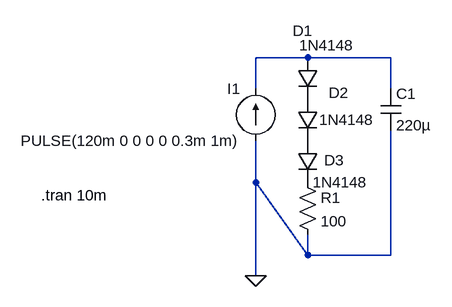
[diagram p0: schematic PWM_led_LPF_combination.asc]
PWM_led_LPF_combination.asc, the LTspice schematic file:
Version 4
SHEET 1 880 680
WIRE 192 80 112 80
WIRE 320 80 192 80
WIRE 112 128 112 80
WIRE 320 128 320 80
WIRE 112 272 112 208
WIRE 192 384 112 272
WIRE 192 384 192 352
WIRE 320 384 320 192
WIRE 320 384 192 384
WIRE 112 416 112 272
FLAG 112 416 0
SYMBOL diode 176 80 R0
WINDOW 0 -7 -41 Left 2
WINDOW 3 3 -19 Left 2
SYMATTR InstName D1
SYMATTR Value 1N4148
SYMBOL diode 176 144 R0
WINDOW 0 48 -10 Left 2
WINDOW 3 34 32 Left 2
SYMATTR InstName D2
SYMATTR Value 1N4148
SYMBOL diode 176 208 R0
WINDOW 0 41 30 Left 2
SYMATTR InstName D3
SYMATTR Value 1N4148
SYMBOL cap 304 128 R0
SYMATTR InstName C1
SYMATTR Value 220µ
SYMBOL current 112 208 R180
WINDOW 0 24 80 Left 2
WINDOW 3 24 0 Left 2
WINDOW 123 0 0 Left 0
WINDOW 39 0 0 Left 0
SYMATTR InstName I1
SYMATTR Value PULSE(120m 0 0 0 0 0.3m 1m)
SYMBOL res 176 256 R0
SYMATTR InstName R1
SYMATTR Value 100
TEXT -218 292 Left 2 !.tran 10m

The netlist it stands for:
* PWM_led_LPF_combination.asc
D1 N001 P001 1N4148
D2 P001 P002 1N4148
D3 P002 P003 1N4148
C1 N001 0 220µ
I1 0 N001 PULSE(120m 0 0 0 0 0.3m 1m)
R1 P003 0 100
.model D D
.lib standard.dio
.tran 10m
.backanno
.end